# EasyEDA Pro project ProPrj_ODrive_2025-02-09.epro, board ODrive1
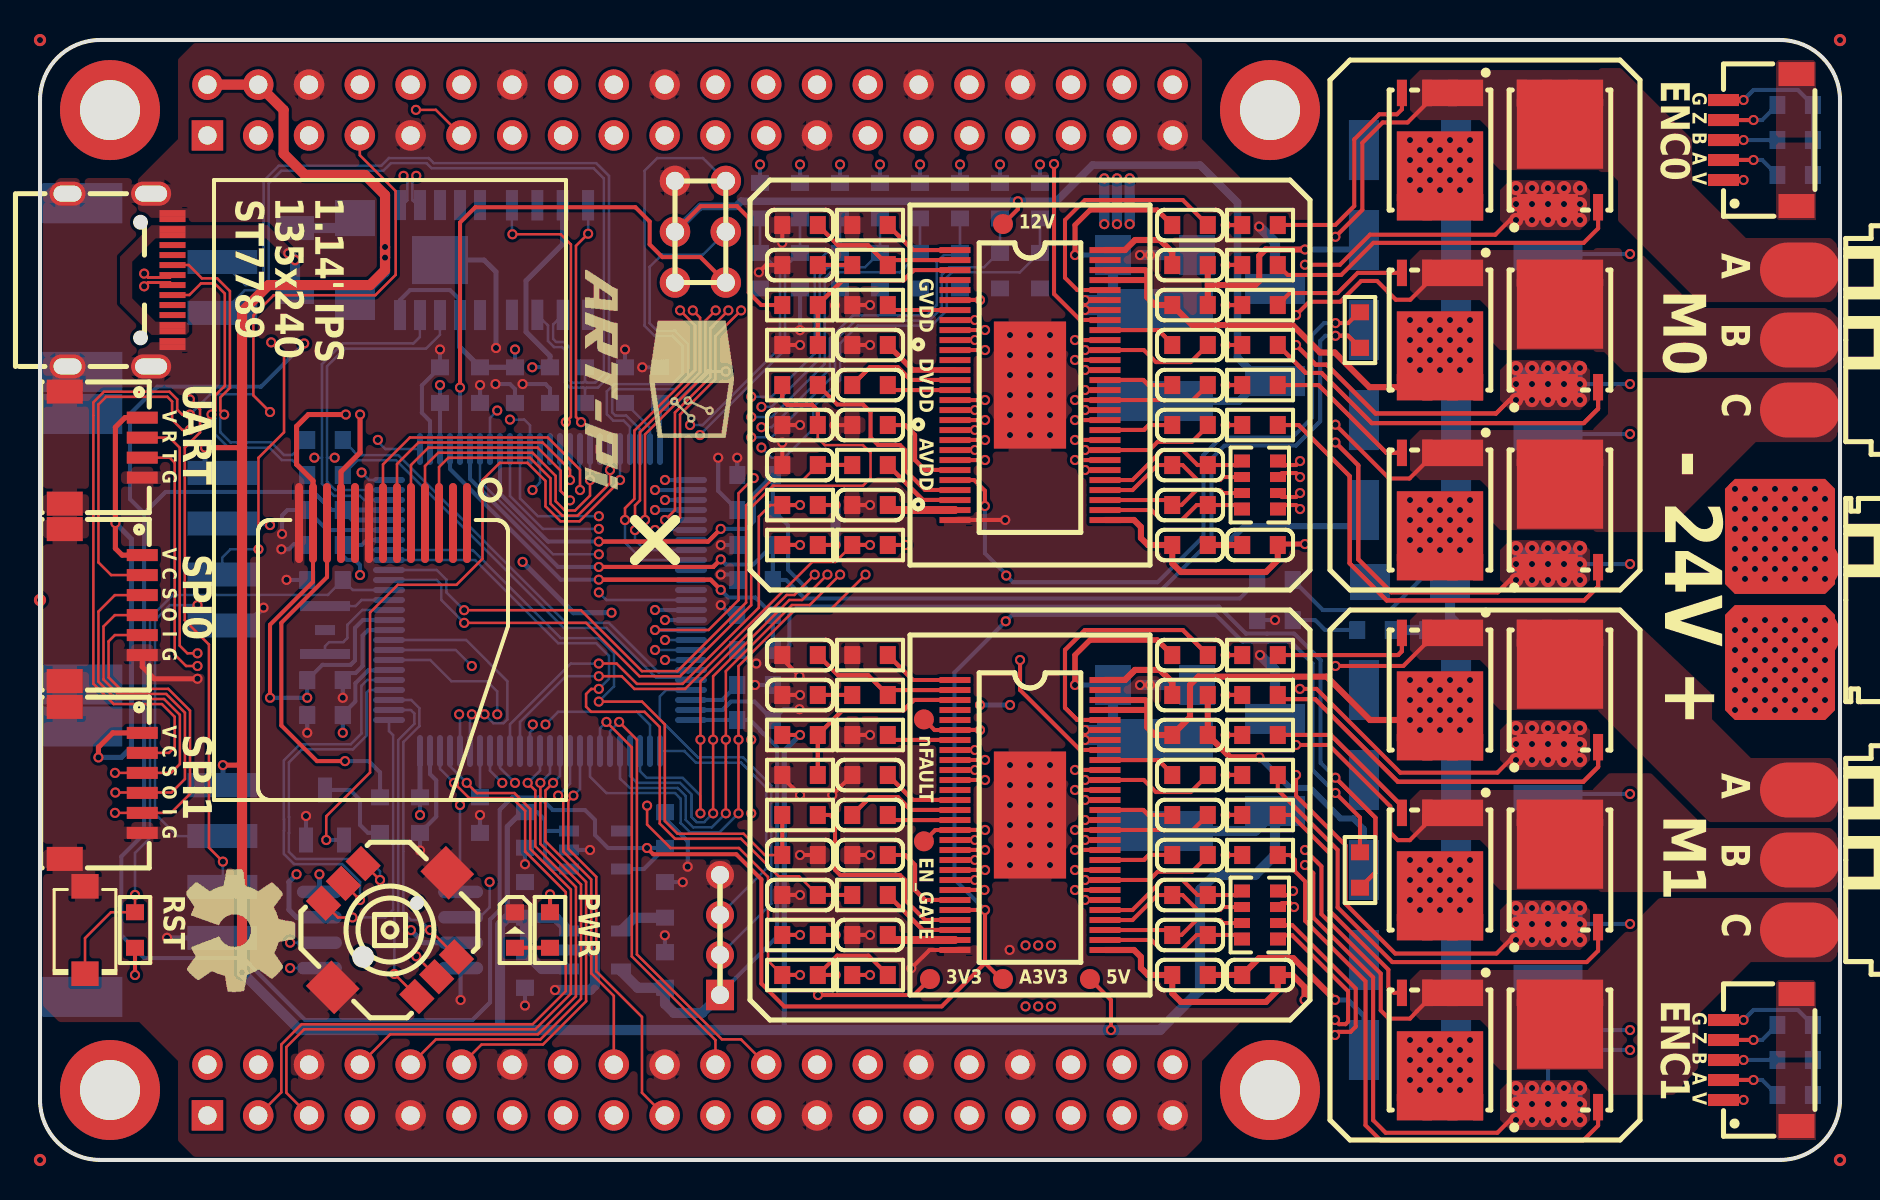
[diagram p9: board, top side]
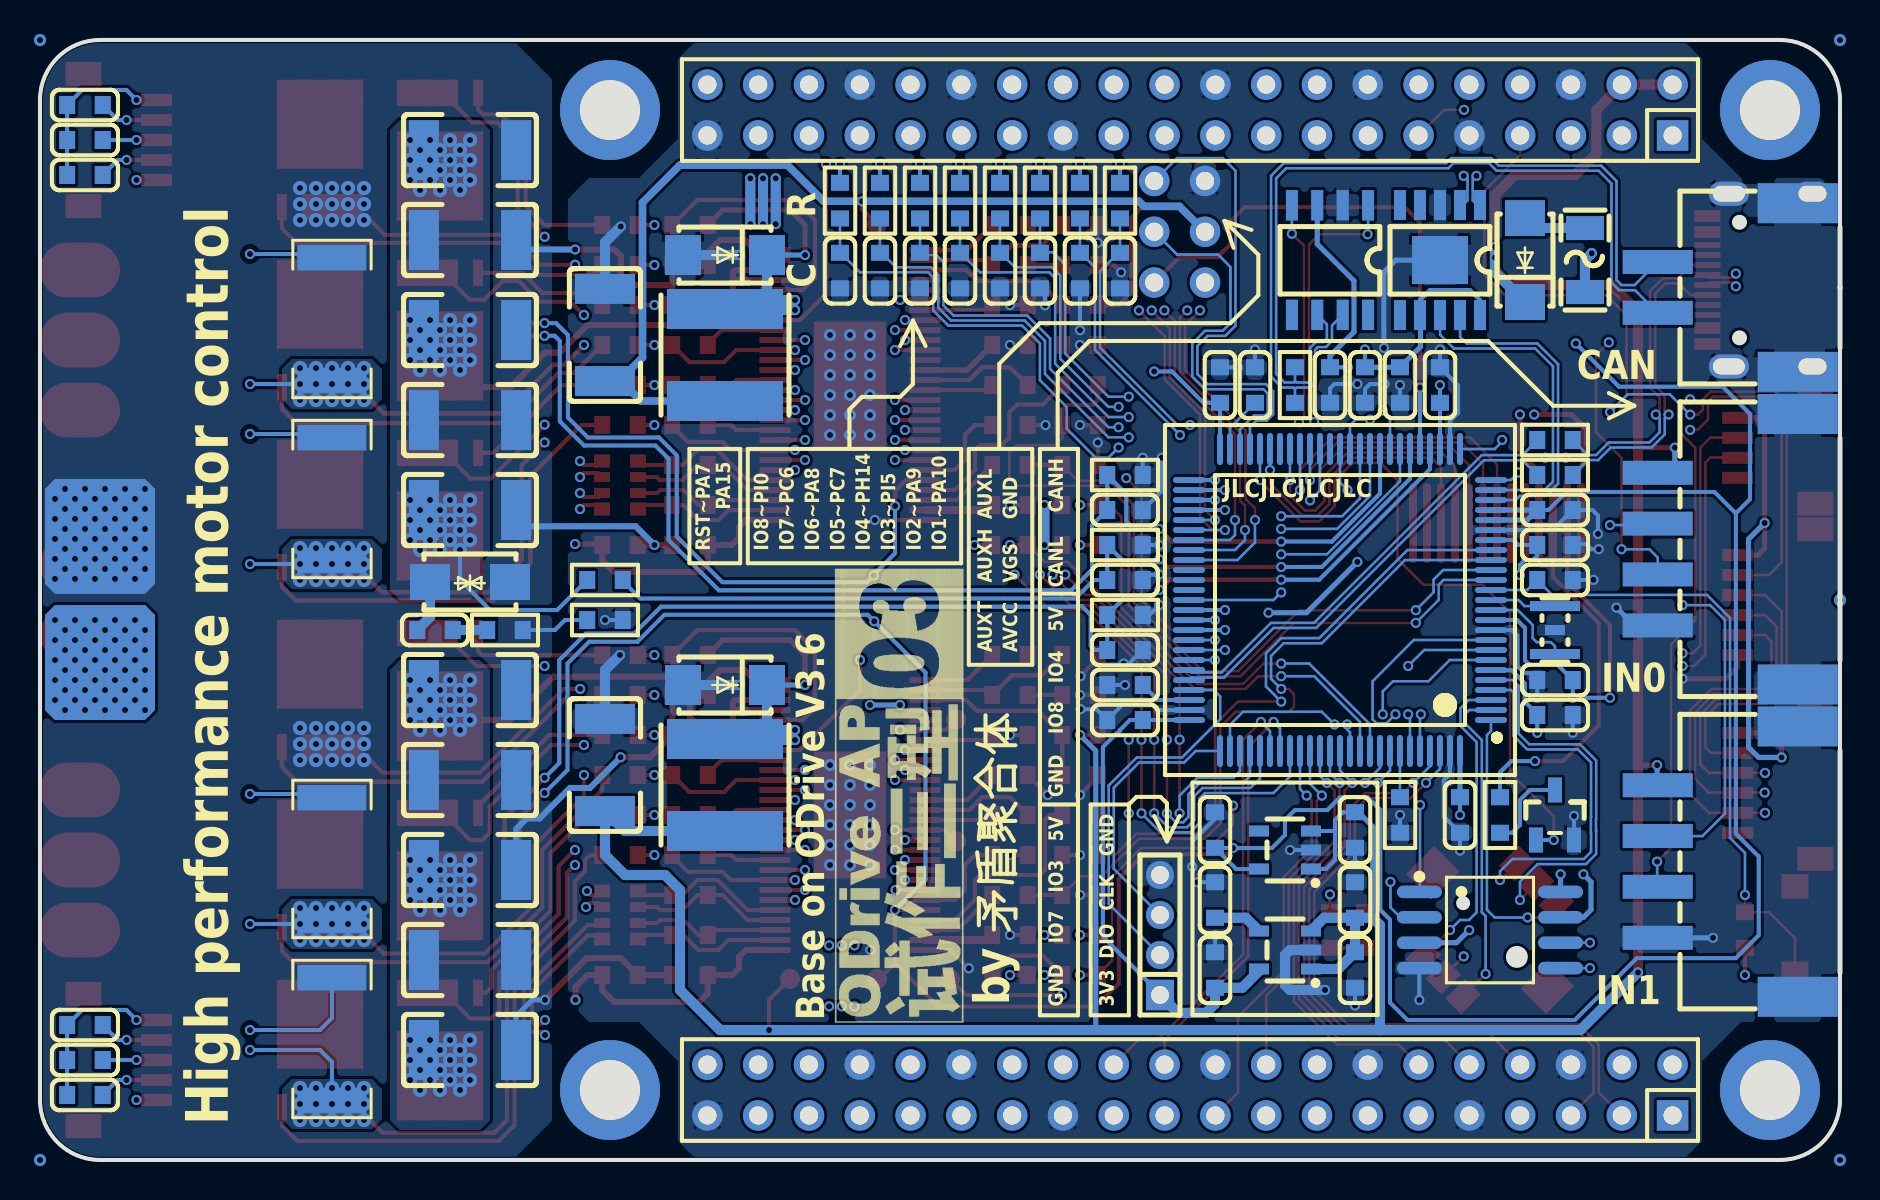
[diagram p10: board, bottom side, seen from below]

Outline 90 x 56 mm; copper layers: Top Layer, Inner1, Inner2, Bottom Layer. Coordinates in mm from the lower left corner of the outline.
Outline path: 0,53 arc(0.88,55.12) 3,56 87,56 arc(89.12,55.12) 90,53 90,3 arc(89.12,0.88) 87,0 3,0 arc(0.88,0.88) 0,3 0,53
Stack: Top Layer 0.035mm / Dielectric1 0.48mm PP er 4.5 / Inner1 0.035mm / Dielectric2 0.48mm FR4 er 4.5 / Inner2 0.035mm / Dielectric3 0.48mm PP er 4.5 / Bottom Layer 0.035mm

## Design rules (mm)
spacing Default (default): track to track 0.102, other pairs 0 to 0.102
track width Default (default): min 0.102, default 0.102, max 25.4
differential pair differentialPair (default): width min 0.127, default 0.254, max 2.54; gap min 0.152, default 0.152
via Default (default): diameter min 0.508, default 0.508, max 100.025; hole min 0.305, default 0.305, max 59.995
pour e1 uses gge36994
pour e3 uses gge16096
pour e7 uses gge36994(1)
pour e13 uses gge16096(1)
pour e2511 uses gge36994(2)
pour e2521 uses gge117911
pour e2523 uses gge117915
pour e2525 uses gge117920
pour e2527 uses gge118000
pour e2529 uses gge118003
pour e2531 uses gge118007
pour e3446 uses gge36994(3)
pour e3476 uses gge36994(4)
pour e3506 uses gge16096(2)

## Placement (name value [footprint] x y rotation side)
C1  82p/50V  [C0603]  48 44.47 270 bottom
C2  2.2u/50V  [C0603]  35.75 29 0 bottom
C3  82p/50V  [C0603]  50 44.47 270 bottom
C4  1u/16V  [C0603]  23.75 38.75 90 bottom
C5  100n/50V  [C0603]  22 38.75 90 bottom
C6  82p/50V  [C0603]  46 44.47 270 bottom
C7  100n/50V  [C0603]  25.5 38.75 90 bottom
C8  82p/50V  [C0603]  44 44.47 270 bottom
C9  82p/50V  [C0603]  42 44.47 270 bottom
C10  2.2u/50V  [C0603]  35.75 23.75 180 bottom
C11  2.2u/50V  [C0603]  29.25 38.75 270 bottom
C12  82p/50V  [C0603]  40 44.47 270 bottom
C13  100n/50V  [C0603]  14.25 30.75 0 bottom
C14  100n/50V  [C0603]  35.75 22 180 bottom
C15  100n/50V  [C0603]  20 38.75 270 bottom
C16  100n/50V  [C0603]  31 38.75 270 bottom
C17  100n/50V  [C0603]  19 17.25 90 bottom
C18  100n/50V  [C0603]  14.25 22.25 0 bottom
C19  100n/50V  [C0603]  14.25 24 180 bottom
C20  100n/50V  [C0603]  14.25 32.5 0 bottom
C21  82p/50V  [C0603]  38 44.47 270 bottom
C22  82p/50V  [C0603]  36 44.47 270 bottom
C23  100n/50V  [C0603]  14.25 29 0 bottom
C24  47uF/50V  [C1812]  68.5 10 180 bottom
C25  47uF/50V  [C1812]  68.5 23.5 180 bottom
C26  47uF/50V  [C1812]  68.5 19 180 bottom
C27  47uF/50V  [C1812]  68.5 50.5 180 bottom
C28  47uF/50V  [C1812]  68.5 41.5 180 bottom
C29  47uF/50V  [C1812]  68.5 14.5 180 bottom
C30  47uF/50V  [C1812]  68.5 46 180 bottom
C31  47uF/50V  [C1812]  68.5 32.5 180 bottom
C32  47uF/50V  [C1812]  68.5 37 180 bottom
C33  47uF/50V  [C1812]  68.5 5.5 180 bottom
C34  1u/16V  [C0603]  24.25 16.5 90 bottom
C35  1u/16V  [C0603]  31.25 16.5 270 bottom
C36  10uF/10V  [C0603]  24.25 13 270 bottom
C37  100n/50V  [C0603]  24.25 9.5 90 bottom
C38  10uF/10V  [C0603]  31.25 9.5 270 bottom
C39  22n/50V  [C0603]  31.25 13 270 bottom
C40  100n/50V  [C0603]  70.25 26.5 0 bottom
C41  3.3n/50V  [C0603]  57.5 44.75 180 top
C42  6.8p/50V  [C0603]  38 46.75 0 top
C43  5.1n/50V  [C0603]  38 44.75 0 top
C44  2.2u/50V  [C0603]  57.5 42.75 180 top
C45  100n/50V  [C0603]  57.5 46.75 180 top
C46  47u/35V  [C1812]  61.75 41.25 270 bottom
C47  2.2u/50V  [C0603]  35.75 32.5 0 bottom
C48  100n/50V  [C0603]  57.5 40.75 180 top
C49  2.2u/50V  [C0603]  41.5 40.75 0 top
C50  22n/50V  [C0603]  41.5 38.75 180 top
C51  100n/50V  [C0603]  57.5 38.75 180 top
C52  2.2u/50V  [C0603]  41.5 36.75 180 top
C53  100n/50V  [C0603]  57.5 36.75 180 top
C54  2.2n/50V  [C0603]  57.5 34.75 0 top
C55  2.2n/50V  [C0603]  38 36.75 0 top
C56  2.2n/50V  [C0603]  38 34.75 0 top
C57  2.2n/50V  [C0603]  57.5 32.75 180 top
C58  2.2u/50V  [C0603]  41.5 32.75 0 top
C59  100n/50V  [C0603]  57.5 30.75 180 top
C60  4.7u/35V  [C0603]  61 30.75 0 top
C61  6.8n/100V  [C0603]  57.5 23.25 180 top
C62  6.8p/50V  [C0603]  38 25.25 0 top
C63  4.3n/50V  [C0603]  38 23.25 0 top
C64  2.2u/50V  [C0603]  57.5 21.25 180 top
C65  100n/50V  [C0603]  57.5 25.25 180 top
C66  47u/35V  [C1812]  61.75 19.75 270 bottom
C67  2.2u/50V  [C0603]  35.75 25.5 0 bottom
C68  100n/50V  [C0603]  57.5 19.25 180 top
C69  2.2u/50V  [C0603]  41.5 19.25 0 top
C70  22n/50V  [C0603]  41.5 17.25 180 top
C71  100n/50V  [C0603]  57.5 17.25 180 top
C72  2.2u/50V  [C0603]  41.5 15.25 180 top
C73  100n/50V  [C0603]  57.5 15.25 180 top
C74  2.2n/50V  [C0603]  57.5 13.25 0 top
C75  2.2n/50V  [C0603]  38 15.25 180 top
C76  2.2n/50V  [C0603]  38 13.25 0 top
C77  2.2n/50V  [C0603]  57.5 11.25 180 top
C78  2.2u/50V  [C0603]  41.5 11.25 0 top
C79  100n/50V  [C0603]  57.5 9.25 180 top
C80  4.7u/35V  [C0603]  61 9.25 0 top
C81  40n/50V  [C0603]  87.75 51 180 bottom
C82  40n/50V  [C0603]  87.75 52.75 180 bottom
C83  40n/50V  [C0603]  87.75 49.25 180 bottom
C84  40n/50V  [C0603]  87.75 6.75 180 bottom
C85  40n/50V  [C0603]  87.75 5 180 bottom
C86  40n/50V  [C0603]  87.75 3.25 180 bottom
CN1  M1010RS-04P  [CONN-SMD_M1010RS-04P]  3.18 35.62 270 top
CN2  XH2.54-2P  [CONN-SMD_2.54-2P-WT]  5.71 43.62 90 bottom
CN3  XH2.54-4P  [CONN-SMD_2.54-4P-WT]  5.71 14.92 90 bottom
CN4  M1010RS-06P  [CONN-SMD_M1010RS-06P]  3.17 27.74 270 top
CN5  XH2.54-4P  [CONN-SMD_2.54-4P-WT]  5.71 30.54 90 bottom
CN6  M1010RS-06P  [CONN-SMD_M1010RS-06P]  3.17 18.85 270 top
CN7  M1010RS-05P  [CONN-SMD_M1010RS-05P]  86 51 270 top
CN8  M1010RS-05P  [CONN-SMD_M1010RS-05P]  86 5 270 top
D1  SS34  [SMA_L4.4-W2.8-LS5.4-RD]  15.75 45 90 bottom
D2  SMAJ30CA_C266339  [SMA_L4.4-W2.6-LS5.0-BI]  68.5 28.9 180 bottom
D3  SS34  [SMA_L4.4-W2.8-LS5.4-RD]  55.75 45.25 0 bottom
D4  SS34  [SMA_L4.4-W2.8-LS5.4-RD]  55.75 23.75 0 bottom
F1  FSMD012-1206-R  [F1206]  12.75 45 270 bottom
H1  PZ200V-11-04P  [HDR-TH_4P-P2.00-V-M]  34 11.25 90 bottom
H2  -  [XT30U-M]  88 28 270 top
H3  ODRIVE  [ODRIVE_LOGO_H3.5]  30.75 17.75 270 top
H4  OSHW  [OSHW_LOGO_H10——NOTEXT]  9 11.5 270 top
H5  ART Pi  [MoonGrt]  31 39 270 top
H6  试作二型  [试作三型_LOGO]  47.06 18.2 90 bottom
H7  -  [MR30-M]  88 41 270 top
H8  -  [MR30-M]  88 15 270 top
KEY  TM-4175-B-B  [SW-SMD_TM-4175-B-B]  17.5 11.5 315 top
L1  120uH  [IND-SMD_L6.0-W6.0]  55.75 40.25 270 bottom
L2  22uH  [IND-SMD_L6.0-W6.0]  55.75 18.75 270 bottom
LED1  LED-0603_B  [LED0603_BLUE]  23.75 11.5 90 top
NOREF  -  [Pad_e3508]  87 31.18 0 top
NOREF#2  -  [Pad_e6219]  3.5 52.5 270 top
NOREF#3  -  [Pad_e2534]  87 24.87 0 top
NOREF#4  -  [Pad_e2533]  87 31.18 0 top
NOREF#5  -  [Pad_e3509]  87 24.87 0 top
NOREF#6  -  [Pad_e6221]  3.5 3.5 270 top
NOREF#7  -  [Pad_e6222]  61.5 3.5 270 top
NOREF#8  -  [Pad_e6220]  61.5 52.5 270 top
P1  ART-Pi -P1扩展引脚  [MY_HDR-TH_40P-P2.54-V-M-R2-C20-S2.54]  32.5 52.5 0 top
P2  ART-Pi -P2扩展引脚  [MY_HDR-TH_40P-P2.54-V-M-R2-C20-S2.54]  32.5 3.5 0 top
PIN1  -  [1PIN]  31.75 46.41 0 top
PIN2  -  [1PIN]  34.29 43.87 0 top
PIN3  -  [1PIN]  34.29 48.95 0 top
PIN4  -  [1PIN]  34.29 46.41 0 top
PIN5  -  [1PIN]  31.75 48.95 0 top
PIN6  -  [1PIN]  31.75 43.87 0 top
Q1  KRC116S-RTK/P  [SOT-23-3_L2.9-W1.6-P1.90-LS2.8-BR]  14.25 17.25 270 bottom
Q2  KNY3406C  [PDFNWB-8L_L6.0-W5.0-P1.27-BL-EP_CON]  70 50.5 180 top
Q3  KNY3406C  [PDFNWB-8L_L6.0-W5.0-P1.27-BL-EP_CON]  70 41.5 180 top
Q4  KNY3406C  [PDFNWB-8L_L6.0-W5.0-P1.27-BL-EP_CON]  70 32.5 180 top
Q5  KNY3406C  [PDFNWB-8L_L6.0-W5.0-P1.27-BL-EP_CON]  76 50.5 0 top
Q6  KNY3406C  [PDFNWB-8L_L6.0-W5.0-P1.27-BL-EP_CON]  76 41.5 0 top
Q7  KNY3406C  [PDFNWB-8L_L6.0-W5.0-P1.27-BL-EP_CON]  76 32.5 0 top
Q8  KNY3406C  [PDFNWB-8L_L6.0-W5.0-P1.27-BL-EP_CON]  70 23.5 180 top
Q9  KNY3406C  [PDFNWB-8L_L6.0-W5.0-P1.27-BL-EP_CON]  70 14.5 180 top
Q10  KNY3406C  [PDFNWB-8L_L6.0-W5.0-P1.27-BL-EP_CON]  70 5.5 180 top
Q11  KNY3406C  [PDFNWB-8L_L6.0-W5.0-P1.27-BL-EP_CON]  76 23.5 0 top
Q12  KNY3406C  [PDFNWB-8L_L6.0-W5.0-P1.27-BL-EP_CON]  76 14.5 0 top
Q13  KNY3406C  [PDFNWB-8L_L6.0-W5.0-P1.27-BL-EP_CON]  76 5.5 0 top
R1  3.3k  [R0603]  48 47.97 270 bottom
R2  10k  [R0603]  61.75 29 180 bottom
R3  22R  [R0603]  14.25 34.25 180 bottom
R4  1k  [R0603]  35.75 30.75 180 bottom
R5  3.3k  [R0603]  50 47.97 270 bottom
R6  22R  [R0603]  14.25 36 180 bottom
R7  3.3k  [R0603]  46 47.97 270 bottom
R8  120R  [R0603]  27.25 38.75 90 bottom
R9  3.3k  [R0603]  44 47.97 270 bottom
R10  1k  [R0603]  25.5 11.5 270 top
R11  3.3k  [R0603]  42 47.97 270 bottom
R12  10k  [R0603]  22 17.25 270 bottom
R13  3.3k  [R0603]  40 47.97 270 bottom
R14  3.3k  [R0603]  38 47.97 270 bottom
R15  10R  [R0603]  17 17.25 90 bottom
R16  3.3k  [R0603]  36 47.97 270 bottom
R17  10k  [R0603]  4.75 11.5 90 top
R18  3.3R  [R0603]  66.75 26.5 0 bottom
R19  0R  [R0603]  61.75 27 180 bottom
R20  133k  [R0603]  41.5 44.75 180 top
R21  562k  [R0603]  41.5 46.75 180 top
R22  140k  [R0603]  38 42.75 0 top
R23  3.3k  [R0603]  41.5 30.75 180 top
R24  3.3k  [R0603]  38 32.75 180 top
R25  3.3k  [R0603]  38 30.75 180 top
R26  10k  [R0603]  38 40.75 180 top
R27  18k  [R0603]  41.5 42.75 180 top
R28  3.3k  [R0603]  35.75 34.25 180 bottom
R29  22R  [R0603]  38 38.75 180 top
R30  22R  [R0603]  41.5 34.75 180 top
R31  2.2R  [R0603]  61 46.75 180 top
R32  2.2R  [R0603]  61 42.75 180 top
R33  2.2R  [R0603]  61 38.75 180 top
R34  2.2R  [R0603]  61 44.75 180 top
R35  2.2R  [R0603]  61 40.75 180 top
R36  2.2R  [R0603]  61 36.75 180 top
R37  0.0005  [R2512]  75.4 42.05 270 bottom
R38  0.0005  [R2512]  75.4 33.05 270 bottom
R39  86.6k  [R0603]  41.5 23.25 180 top
R40  365k  [R0603]  41.5 25.25 180 top
R41  52.3k  [R0603]  38 21.25 0 top
R42  3.3k  [R0603]  41.5 9.25 180 top
R43  3.3k  [R0603]  38 11.25 180 top
R44  3.3k  [R0603]  38 9.25 180 top
R45  10k  [R0603]  38 19.25 180 top
R46  18k  [R0603]  41.5 21.25 180 top
R47  3.3k  [R0603]  35.75 27.25 180 bottom
R48  22R  [R0603]  38 17.25 180 top
R49  22R  [R0603]  41.5 13.25 180 top
R50  2.2R  [R0603]  61 25.25 180 top
R51  2.2R  [R0603]  61 21.25 180 top
R52  2.2R  [R0603]  61 17.25 180 top
R53  2.2R  [R0603]  61 23.25 180 top
R54  2.2R  [R0603]  61 19.25 180 top
R55  2.2R  [R0603]  61 15.25 180 top
R56  0.0005  [R2512]  75.4 15.05 270 bottom
R57  0.0005  [R2512]  75.4 6.05 270 bottom
RN1  100R  [RES-ARRAY-SMD_0603-8P-L3.2-W1.6-BL]  61 33.75 90 top
RN2  100R  [RES-ARRAY-SMD_0603-8P-L3.2-W1.6-BL]  61 12.25 90 top
RT1  10k  [R0603]  66 41.5 90 top
RT2  10k  [R0603]  66 14.5 90 top
SW1  TS-1088R-02026  [SW-SMD_L3.9-W3.0-P4.45]  2.25 11.5 270 top
TFT1  焊接式_TFT_1.14_135x240_13pin  [焊接式_TFT_1.14_135X240_13PIN]  17.5 18 270 top
TP1  Testpoint 1.6mm  [TESTPOINT 1.6MM#2]  44.19 15.93 0 top
TP2  Testpoint 1.6mm  [TESTPOINT 1.6MM#2]  44.19 22.03 0 top
TP3  Testpoint 1.6mm  [TESTPOINT 1.6MM#2]  44.5 9.05 0 top
TP4  Testpoint 1.6mm  [TESTPOINT 1.6MM#2]  48.15 9.05 0 top
TP5  Testpoint 1.6mm  [TESTPOINT 1.6MM#2]  52.5 9.05 0 top
TP6  Testpoint 1.6mm  [TESTPOINT 1.6MM]  49.05 46.8 0 top
U1  W25Q32FVSSIGTR  [SOIC-8_L5.3-W5.3-P1.27-LS8.0-BL]  17.5 11.5 270 bottom
U2  CH340K  [ESOP-10_L4.9-W3.9-P1.00-LS6.2-BL-EP]  20 45 0 bottom
U3  STM32F405VGT6  [LQFP-100_L14.0-W14.0-P0.50-LS16.0-BL]  25 28 90 bottom
U4  SN65HVD232DR  [SOIC-8_L5.0-W4.0-P1.27-LS6.0-BL]  25.5 45 0 bottom
U6  LP5907MFX-3.3/NOPB  [SOT-23-5_L3.0-W1.7-P0.95-LS2.8-BR]  27.75 15.5 180 bottom
U7  DRV8301DCAR  [HTSSOP-56_L14.0-W6.0-P0.50-LS8.0-BL]  49.5 38.75 270 top
U8  DRV8301DCAR  [HTSSOP-56_L14.0-W6.0-P0.50-LS8.0-BL]  49.5 17.25 270 top
U9  RT9193-33GB  [SOT-23-5_L3.0-W1.7-P0.95-LS2.8-BR]  27.75 10.5 180 bottom
USBC1  TYPE-C-31-M-12  [USB-C_SMD-TYPE-C-31-M-12]  4 44 270 top
X1  8MHz  [OSC-SMD_3P-L3.2-W1.3-P1.2-L]  14.25 26.5 90 bottom

## Footprints (pads in the part's own frame, mm; a bottom-side part is the same pattern mirrored in y, then rotated)
1PIN
  round 1.524 hole 0.914: 1(0,0)
C0603
  rect 0.8x0.9 smd: 1(-0.889,0) 2(0.889,0)
C1812
  rect 1.5x3 smd: 1(-2.305,0) 2(2.305,0)
CONN-SMD_2.54-2P-WT
  rect 2x4 smd: 0(-4.21,-3.6) 0(4.22,-3.6)
  rect 1.2x3.5 smd: 1(1.28,3.4) 2(-1.26,3.4)
CONN-SMD_2.54-4P-WT
  rect 2x4 smd: 0(-6.76,-3.6) 0(6.76,-3.6)
  rect 1.2x3.5 smd: 1(3.82,3.4) 2(1.28,3.4) 3(-1.26,3.4) 4(-3.81,3.4)
CONN-SMD_M1010RS-04P
  rect 0.6x1.55 smd: 1(-1.5,1.938) 2(-0.5,1.938) 3(0.5,1.938) 4(1.5,1.938)
  rect 1.2x1.8 smd: 5(2.8,-1.938) 6(-2.8,-1.938)
CONN-SMD_M1010RS-05P
  rect 0.6x1.55 smd: 1(2,-1.825) 2(1,-1.825) 3(0,-1.825) 4(-1,-1.825) 5(-2,-1.825)
  rect 1.2x1.8 smd: 6(-3.3,1.825) 7(3.3,1.825)
CONN-SMD_M1010RS-06P
  rect 0.6x1.55 smd: 1(-2.5,1.938) 2(-1.5,1.938) 3(-0.5,1.938) 4(0.5,1.938) 5(1.5,1.938) 6(2.5,1.938)
  rect 1.2x1.8 smd: 7(3.8,-1.938) 8(-3.8,-1.938)
ESOP-10_L4.9-W3.9-P1.00-LS6.2-BL-EP
  rect 2.8x2.4 smd: 0(0,0)
  rect 0.6x1.5 smd: 1(-2,-2.75) 2(-1,-2.75) 3(0,-2.75) 4(1,-2.75) 5(2,-2.75) 6(2,2.75) 7(1,2.75) 8(0,2.75) 9(-1,2.75) 10(-2,2.75)
F1206
  rect 1.2x1.9 smd: 1(-1.6,0) 2(1.6,0)
HDR-TH_4P-P2.00-V-M
  rect 1.524x1.4 hole 0.9: 1(-3,0)
  round 1.4 hole 0.9: 2(-1,0) 3(1,0) 4(3,0)
HTSSOP-56_L14.0-W6.0-P0.50-LS8.0-BL
  rect 0.3x1.55 smd: 1(-6.75,-3.75) 2(-6.25,-3.75) 3(-5.75,-3.75) 4(-5.25,-3.75) 5(-4.75,-3.75) 6(-4.25,-3.75) 7(-3.75,-3.75) 8(-3.25,-3.75) 9(-2.75,-3.75) 10(-2.25,-3.75) 11(-1.75,-3.75) 12(-1.25,-3.75) 13(-0.75,-3.75) 14(-0.25,-3.75) 15(0.25,-3.75) 16(0.75,-3.75) 17(1.25,-3.75) 18(1.75,-3.75) 19(2.25,-3.75) 20(2.75,-3.75) 21(3.25,-3.75) 22(3.75,-3.75) 23(4.25,-3.75) 24(4.75,-3.75) 25(5.25,-3.75) 26(5.75,-3.75) 27(6.25,-3.75) 28(6.75,-3.75) 29(6.75,3.75) 30(6.25,3.75) 31(5.75,3.75) 32(5.25,3.75) 33(4.75,3.75) 34(4.25,3.75) 35(3.75,3.75) 36(3.25,3.75) 37(2.75,3.75) 38(2.25,3.75) 39(1.75,3.75) 40(1.25,3.75) 41(0.75,3.75) 42(0.25,3.75) 43(-0.25,3.75) 44(-0.75,3.75) 45(-1.25,3.75) 46(-1.75,3.75) 47(-2.25,3.75) 48(-2.75,3.75) 49(-3.25,3.75) 50(-3.75,3.75) 51(-4.25,3.75) 52(-4.75,3.75) 53(-5.25,3.75) 54(-5.75,3.75) 55(-6.25,3.75) 56(-6.75,3.75)
  rect 6.35x3.61 smd: 57(0,0)
IND-SMD_L6.0-W6.0
  rect 2x5.8 smd: 1(-2.3,0) 2(2.3,0)
LED0603_BLUE
  rect 0.8x0.9 smd: 1(-0.889,0) 2(0.888,0)
LQFP-100_L14.0-W14.0-P0.50-LS16.0-BL
  oval 0.3x1.6 smd: 1(-6,-7.55) 2(-5.5,-7.55) 3(-5,-7.55) 4(-4.5,-7.55) 5(-4,-7.55) 6(-3.5,-7.55) 7(-3,-7.55) 8(-2.5,-7.55) 9(-2,-7.55) 10(-1.5,-7.55) 11(-1,-7.55) 12(-0.5,-7.55) 13(0,-7.55) 14(0.5,-7.55) 15(1,-7.55) 16(1.5,-7.55) 17(2,-7.55) 18(2.5,-7.55) 19(3,-7.55) 20(3.5,-7.55) 21(4,-7.55) 22(4.5,-7.55) 23(5,-7.55) 24(5.5,-7.55) 25(6,-7.55) 51(6,7.55) 52(5.5,7.55) 53(5,7.55) 54(4.5,7.55) 55(4,7.55) 56(3.5,7.55) 57(3,7.55) 58(2.5,7.55) 59(2,7.55) 60(1.5,7.55) 61(1,7.55) 62(0.5,7.55) 63(0,7.55) 64(-0.5,7.55) 65(-1,7.55) 66(-1.5,7.55) 67(-2,7.55) 68(-2.5,7.55) 69(-3,7.55) 70(-3.5,7.55) 71(-4,7.55) 72(-4.5,7.55) 73(-5,7.55) 74(-5.5,7.55) 75(-6,7.55)
  oval 1.6x0.3 smd: 26(7.55,-6) 27(7.55,-5.5) 28(7.55,-5) 29(7.55,-4.5) 30(7.55,-4) 31(7.55,-3.5) 32(7.55,-3) 33(7.55,-2.5) 34(7.55,-2) 35(7.55,-1.5) 36(7.55,-1) 37(7.55,-0.5) 38(7.55,0) 39(7.55,0.5) 40(7.55,1) 41(7.55,1.5) 42(7.55,2) 43(7.55,2.5) 44(7.55,3) 45(7.55,3.5) 46(7.55,4) 47(7.55,4.5) 48(7.55,5) 49(7.55,5.5) 50(7.55,6) 76(-7.55,6) 77(-7.55,5.5) 78(-7.55,5) 79(-7.55,4.5) 80(-7.55,4) 81(-7.55,3.5) 82(-7.55,3) 83(-7.55,2.5) 84(-7.55,2) 85(-7.55,1.5) 86(-7.55,1) 87(-7.55,0.5) 88(-7.55,0) 89(-7.55,-0.5) 90(-7.55,-1) 91(-7.55,-1.5) 92(-7.55,-2) 93(-7.55,-2.5) 94(-7.55,-3) 95(-7.55,-3.5) 96(-7.55,-4) 97(-7.55,-4.5) 98(-7.55,-5) 99(-7.55,-5.5) 100(-7.55,-6)
MR30-M
  oval 2.75x4 smd: 1(-3.5,0) 2(0,0) 3(3.5,0)
MY_HDR-TH_40P-P2.54-V-M-R2-C20-S2.54
  rect 1.575x1.524 hole 0.914: 1(-24.13,-1.27)
  round 1.524 hole 0.914: 2(-24.13,1.27) 3(-21.59,-1.27) 4(-21.59,1.27) 5(-19.05,-1.27) 6(-19.05,1.27) 7(-16.51,-1.27) 8(-16.51,1.27) 9(-13.97,-1.27) 10(-13.97,1.27) 11(-11.43,-1.27) 12(-11.43,1.27) 13(-8.89,-1.27) 14(-8.89,1.27) 15(-6.35,-1.27) 16(-6.35,1.27) 17(-3.81,-1.27) 18(-3.81,1.27) 19(-1.27,-1.27) 20(-1.27,1.27) 21(1.27,-1.27) 22(1.27,1.27) 23(3.81,-1.27) 24(3.81,1.27) 25(6.35,-1.27) 26(6.35,1.27) 27(8.89,-1.27) 28(8.89,1.27) 29(11.43,-1.27) 30(11.43,1.27) 31(13.97,-1.27) 32(13.97,1.27) 33(16.51,-1.27) 34(16.51,1.27) 35(19.05,-1.27) 36(19.05,1.27) 37(21.59,-1.27) 38(21.59,1.27) 39(24.13,-1.27) 40(24.13,1.27)
OSC-SMD_3P-L3.2-W1.3-P1.2-L
  rect 0.5x2.5 smd: 1(-1.199,0) 3(1.199,0)
  rect 0.5x1 smd: 2(0,0)
Pad_e2533
  custom 0x0 smd: 1(0,0)
Pad_e2534
  custom 0x0 smd: 4(0,0)
Pad_e3508
  custom 0x0 smd far side: 3(0,0)
Pad_e3509
  custom 0x0 smd far side: 2(0,0)
Pad_e6219
  round 5 hole 3: N(0,0)
Pad_e6220
  round 5 hole 3: N(0,0)
Pad_e6221
  round 5 hole 3: N(0,0)
Pad_e6222
  round 5 hole 3: N(0,0)
PDFNWB-8L_L6.0-W5.0-P1.27-BL-EP_CON
  rect 3.048x1.321 smd: 1(-0.635,-2.857)
  rect 0.5x1.321 smd: 2(-0.635,-2.857) 3(0.635,-2.857) 4(1.905,-2.857) 6(0.635,2.857) 7(-0.635,2.857) 8(-1.905,2.857)
  rect 4.318x1.321 smd: 5(0,2.857)
  rect 4.318x3.5 smd: 8(0,0.812)
R0603
  rect 0.8x0.9 smd: 1(-0.889,0) 2(0.889,0)
R2512
  rect 1.282x3.456 smd: 1(-3.067,0) 2(3.067,0)
RES-ARRAY-SMD_0603-8P-L3.2-W1.6-BL
  rect 0.65x0.8 smd: 1(-1.2,-0.9) 4(1.2,-0.9) 5(1.2,0.9) 8(-1.2,0.9)
  rect 0.5x0.8 smd: 2(-0.4,-0.9) 3(0.4,-0.9) 6(0.4,0.9) 7(-0.4,0.9)
SMA_L4.4-W2.6-LS5.0-BI
  rect 2x1.8 smd: 1(-2,0) 2(2,0)
SMA_L4.4-W2.8-LS5.4-RD
  rect 1.8x2 smd: 1(-2.1,0) 2(2.1,0)
SOIC-8_L5.0-W4.0-P1.27-LS6.0-BL
  rect 0.6x1.52 smd: 1(-1.905,-2.74) 2(-0.635,-2.74) 3(0.635,-2.74) 4(1.905,-2.74) 5(1.905,2.74) 6(0.635,2.74) 7(-0.635,2.74) 8(-1.905,2.74)
SOIC-8_L5.3-W5.3-P1.27-LS8.0-BL
  oval 0.63x2.25 smd: 1(-1.905,-3.53) 2(-0.635,-3.53) 3(0.635,-3.53) 4(1.905,-3.53) 5(1.905,3.53) 6(0.635,3.53) 7(-0.635,3.53) 8(-1.905,3.53)
SOT-23-3_L2.9-W1.6-P1.90-LS2.8-BR
  rect 1.25x0.7 smd: 1(1.25,-0.95) 2(1.25,0.95) 3(-1.25,0)
SOT-23-5_L3.0-W1.7-P0.95-LS2.8-BR
  rect 1x0.55 smd: 1(1.3,-0.95) 2(1.3,0) 3(1.3,0.95) 4(-1.3,0.95) 5(-1.3,-0.95)
SW-SMD_L3.9-W3.0-P4.45
  rect 1.23x1.36 smd: 1(-2.185,0) 2(2.185,0)
SW-SMD_TM-4175-B-B
  rect 1.4x1.1 smd: 1(-3.3,1.4) 2(-3.3,0) 3(-3.3,-1.4) 4(3.3,1.4) 5(3.3,0) 6(3.3,-1.4)
  rect 2x1.8 smd: 7(0,-4.05) 8(0,4.05)
TESTPOINT 1.6MM
  round 1 smd: 1(-0.9,0)
TESTPOINT 1.6MM#2
  round 1 smd: 1(0,0)
USB-C_SMD-TYPE-C-31-M-12
  oval 1.2x2 hole 0.8x1.6: 0(-4.32,1.556) 0(4.32,1.556)
  oval 1.2x1.8 hole 0.8x1.4: 0(-4.32,-2.624) 0(4.32,-2.624)
  rect 0.3x1.3 smd: A1(-3.35,2.623) A4(-2.55,2.623) A5(-1.25,2.623) A6(-0.25,2.623) A7(0.25,2.623) A8(1.25,2.624) A9(2.55,2.623) A12(3.35,2.623) B1(3.05,2.623) B4(2.25,2.623) B5(1.75,2.623) B6(0.75,2.623) B7(-0.75,2.623) B8(-1.75,2.624) B9(-2.25,2.623) B12(-3.05,2.623)
XT30U-M
  oval 2.75x4 smd: 1(-1.778,0) 2(1.722,0)
焊接式_TFT_1.14_135X240_13PIN
  oval 4x0.4 smd: 1(-13.85,3.85) 2(-13.85,3.15) 3(-13.85,2.45) 4(-13.85,1.75) 5(-13.85,1.05) 6(-13.85,0.35) 7(-13.85,-0.35) 8(-13.85,-1.05) 9(-13.85,-1.75) 10(-13.85,-2.45) 11(-13.85,-3.15) 12(-13.85,-3.85) 13(-13.85,-4.55)

## Nets
As in the schematic, except:
PGND: C24.2 C25.2 C26.2 C27.2 C28.2 C29.2 C30.2 C31.2 C32.2 C33.2 C41.1 C44.1 C59.1 C60.1 C61.1 C64.1 C79.1 C80.1 D2.2 H2.1 NOREF.3 NOREF#4.1 Q5.1 Q5.2 Q5.3 Q11.1 Q11.2 Q11.3 R18.1 R19.1 R37.1 R38.1 R56.1 R57.1 RN1.1 RN1.3 RN2.1 RN2.3 U7.44 U8.44
DCBUS: C24.1 C25.1 C26.1 C27.1 C28.1 C29.1 C30.1 C31.1 C32.1 C33.1 C40.2 C44.2 C59.2 C60.2 C64.2 C79.2 C80.2 D2.1 H2.2 NOREF#3.4 NOREF#5.2 Q2.5 Q2.6 Q2.7 Q2.8 Q3.5 Q3.6 Q3.7 Q3.8 Q4.5 Q4.6 Q4.7 Q4.8 Q8.5 Q8.6 Q8.7 Q8.8 Q9.5 Q9.6 Q9.7 Q9.8 Q10.5 Q10.6 Q10.7 Q10.8 R2.1 U7.29 U7.53 U7.54 U8.29 U8.53 U8.54
M0_SN1: Q6.1 Q6.2 Q6.3 R37.2 RN1.4 U7.39
M0_SN2: Q7.1 Q7.2 Q7.3 R38.2 RN1.2 U7.34
M1_SN1: Q12.1 Q12.2 Q12.3 R56.2 RN2.4 U8.39
M1_SN2: Q13.1 Q13.2 Q13.3 R57.2 RN2.2 U8.34

Pads without a net: CN7 6 7; CN8 6 7; NOREF#2 N; NOREF#7 N; NOREF#8 N; P1 1 3 5 13 15 17 27 29 31 32 33 35 36 37 38 40; P2 1 2 4 7 11 13 15 16 17 21 23 26 27 28 29 31 32 33 35 36 37 38 40; TFT1 1 2 9; U2 4 5 6; U3 39 44 60 61 62; U4 5 8; U6 4; U7 4 5 12 55; U8 4 5 12 55; USBC1 A5 A8 B5 B8

## Via types
v1: diameter 0.61, hole 0.305, Top Layer to Bottom Layer, 41 vias
v2: diameter 0.711, hole 0.305, Top Layer to Bottom Layer, 316 vias
v3: diameter 0.508, hole 0.305, Top Layer to Bottom Layer, 380 vias

## Routing (per net, layer and track width the routed paths; a pad name or vN(x,y) marks a point on that pad's centre or on a via; arc(x,y) is an arc through that point)
5V: length 178.7
  Top Layer w0.203: v3(53.55,6.5) 53.55,8 TP5.1 ; R41.1 v3(38,21.25)
  Top Layer w0.254: 10.09,35.62 9.84,35.62 v3(8.25,35.62) ; v3(9.14,19.74) 10.1,19.74 10.1,19.74
  Top Layer w0.508: 17.25,45.65 v3(17.25,45.12) 17.25,44.49 16.51,43.75 11.43,43.75 10.1,42.42 v3(10.1,9.38) ; 17.25,45.12 v3(17.25,45.65) 17.25,48.25 16.25,49.25 13.25,49.25 12.18,50.32 12.18,52.5 P1.4 P1.2
  Bottom Layer w0.203: C34.2 24.86,17.39 25.25,17 25.25,15 25.7,14.55 U6.1 ; U6.3 25.25,16.45
  Bottom Layer w0.254: 24.08,17.39 23.36,16.67 23.36,12.11 ; v3(38,21.25) 37.21,20.46 37.21,6.54 ; 9.11,34.36 8.63,34.36 8.25,34.73 8.25,35.62 ; v3(9.14,19.74) 9.14,18.77 9.11,18.74
  Bottom Layer w0.508: 17.25,45.65 17.25,44.4 15.75,42.9 ; U9.3 25.79,12.11 C36.2 ; C36.2 24.25,10.39 ; C36.2 23.36,12.11 23,11.75 23,6.5 ; U9.1 25.09,9.55 C37.2 ; v3(10.1,9.38) 12.98,6.5 56,6.5 58,8.5 58,13.5 58.75,14.25 60.75,14.25 61.75,15.25 61.75,17.44 60.76,16.45 55.75,16.45 ; 24.08,17.39 24.25,17.39
12V: length 58.4
  Top Layer w0.203: PIN1.1 33.03,47.69 34.85,47.69 35.43,47.11 35.43,43.37 36.05,42.75 37.11,42.75 ; TP6.1 48.9,47.54 v3(48.9,47.94)
  Bottom Layer w0.381: 55.75,37.95 59.95,37.95 60.95,38.94 61.75,38.94 ; 61.75,38.94 61.05,38.94 59.87,40.12 59.87,47.87 58,49.75 52.62,49.75 50.82,47.94 35.06,47.94 34.8,47.68 33.02,47.68 PIN1.1
AVCC: length 226.3
  Top Layer w0.203: 64.77,41.84 65.41,41.84 66,42.44 ; 45.75,12.5 47.25,12.5 ; 45.75,34 46.71,34 47.24,33.46 v3(47.24,32.7) ; 64.77,18.35 66,17.12 66,15.39 ; 47.25,9.84 47.25,12.5 ; 47.25,9.84 45.08,7.68 37.21,7.68 36.07,8.82 36.07,14.03 34.81,15.28 30.66,15.28 v3(30.35,15.6) ; 47.25,9.84 48.05,9.05 TP4.1
  Inner1 w0.203: v3(48.29,26.94) 48.31,26.96 v3(48.31,29.22) 48.34,29.25 ; 31.75,43.87 30.23,43.87 28.58,45.52 21.08,45.52 16.38,40.83 v3(13.21,40.83)
  Bottom Layer w0.203: 15.14,32.5 14.58,32.5 13.67,33.4 6.28,33.4 5.21,32.33 ; 64.77,41.84 64.2,41.84 63.6,41.25 63.6,37.12 62.61,36.13 59.06,36.13 58.17,35.24 58.17,31.17 55.88,28.89 48.65,28.89 v3(48.31,29.22) ; 64.77,18.35 63.63,19.49 63.63,24.82 62.54,25.91 60.12,25.91 58.78,27.26 48.61,27.26 v3(48.29,26.94) 45.72,24.37 45.72,14.03 47.25,12.5 ; v3(13.21,40.82) 11.05,38.66 5.86,38.66 4.5,37.3 4.5,33.04 5.21,32.33 5.21,16.31 4.06,15.17 4.06,11.23 5.21,10.09 10.16,10.09 13.26,7 21.62,7 22.5,7.87 22.5,12.02 22.99,12.5 22.99,17.51 23.61,18.13 25,18.13 25.63,17.5 27.25,17.5 27.75,17 27.75,16.25 28.4,15.6 30.35,15.6 31.25,15.61 30.19,14.55 29.05,14.55 ; 48.34,29.25 47.24,30.34 v3(47.24,32.7)
  Bottom Layer w0.254: 17.45,32.5 15.14,32.5 15.64,32 17.45,32
  vias: v3(47.25,12.5) v3(64.77,41.84) v3(64.77,18.35)
GND: length 218.4
  Top Layer w0.203: 37.22,40.75 37.27,40.7 ; 37.22,40.75 37.11,40.86 R26.2 37.22,40.75 ; 37.22,40.75 v3(38,40.75) ; v3(43.56,9.58) 44.48,10.5 45.75,10.5 ; 37.11,13.25 v3(38,13.25) ; v3(35.94,44.38) 36.3,44.75 37.11,44.75 ; C78.1 v3(41.5,11.25) ; C49.1 v3(41.5,40.75) ; 84.18,53 v3(85.18,53) ; 40.61,32.75 v3(41.5,32.75) ; 40.61,36.75 v3(39.72,36.75) ; 84.18,7 v3(85.18,7) ; 37.11,19.25 37.11,19.14 38,18.25 ; 37.11,34.75 v3(37.11,35.87) ; 37.11,23.25 v3(38,23.25) ; 40.61,15.25 v3(41.5,15.25) ; 45.75,32 v3(48.26,32) ; 40.61,42.75 v3(41.5,42.75) ; 37.11,25.25 37.11,25.05 v3(37.97,24.19) ; v3(37.11,45.86) 37.11,46.75 ; v3(38,15.25) 38.89,15.25 ; R46.2 v3(41.5,21.25) ; 39.61,18.25 40.61,19.25 ; 37.11,36.75 v3(38,36.75)
  Top Layer w0.254: 5.11,25.24 5.11,24.66 5.71,24.06 v3(7.87,24.06)
  Inner1 w0.203: P1.39 58.93,48.93 62.75,48.93 68.01,54.19 80.59,54.19 81.78,53 85.18,53 ; v3(85.18,7) 82.21,7 79.02,10.19 48.88,10.19 48.57,10.5 v3(48.48,10.5)
  Inner2 w0.508: 0.75,28 6.25,28 0.75,28
  Bottom Layer w0.203: U6.2 27.5,15.5 ; 34.86,25.5 35.54,24.82 v3(35.81,24.82) ; R28.2 v3(34.86,35.11) ; 13.36,29 12.33,29 v3(12.33,29.01) ; U3.74 34.12,22.5 34.54,22.92 35.72,22.92 36.64,22 37.18,22.54 v3(37.97,22.54) ; v3(31.24,11.23) 31.24,10.4 31.25,10.39 ; U1.4 v3(21.03,8) ; 31.25,13.89 v3(32.14,13.89) ; v3(39.75,42.73) 39.75,43.33 C12.2 ; v3(32.38,14.66) 32.38,15.93 31.25,17.07 31.25,17.39 ; C82.1 87.89,53.5 85.68,53.5 v3(85.18,53) ; 24.13,38.8 25.27,38.8 25.5,38.57 25.5,37.86 ; v3(33.91,35.11) 33.91,33.45 34.86,32.5 ; 34.86,27.25 34.53,27.25 v3(34.04,27.74) ; 19,15.47 C17.1 19.81,17.17 19.81,18.98 19.5,19.29 19.5,20.45 ; 23.75,37.86 23.75,38.54 23.5,38.8 22.77,38.8 ; 85.18,7 85.68,7.5 87.89,7.5 88.64,6.75 ; v3(15.14,23.11) 15.14,24.05 15.44,24.35 15.78,24.35 16.13,24.7 16.13,26.22 16.41,26.5 17.45,26.5 ; U3.27 19.5,36.95 19.09,37.35 19.09,38.73 20,39.64 v3(20,40.53) ; 13.3,16 v3(13.3,17.2) ; 17.45,31.5 14.36,31.5 13.36,32.5 12.38,32.5 12.1,32.22 v3(12.1,31.3) ; v3(13.36,21.36) 13.36,22.25 ; v3(35.75,23.75) 36.64,23.75 ; 88.64,3.25 88.64,6.75 ; 34.86,29 34.59,29.27 v3(34.04,29.27) ; R19.2 v3(61.75,27) ; R12.2 v3(22,17.25) ; v3(38,41.49) 38,43.61 ; v3(12.06,30.54) 12.45,30.54 12.7,30.79 13.32,30.79 C13.1 ; 22,37.86 v3(22,38.75) ; 88.64,52.75 88.64,49.25 ; v3(34.04,30.75) 34.86,30.75 ; v3(30.11,39.64) 31,39.64 ; v3(24.25,7.72) C37.1 ; 29.25,39.64 v3(29.25,40.53) ; v3(24.25,14.79) 24.25,15.61
  Bottom Layer w0.254: U2.0 22.2,45 22.8,44.4 v3(22.8,40.6) ; v3(11.18,27.62) 10.29,26.73 9.11,26.73 ; v3(6.35,11.11) 9.11,11.11
  Bottom Layer w0.508: v3(55,45.25) 57.85,45.25 ; 61.75,43.55 61.75,45.88 v3(60.96,46.67) ; v3(61,25.25) 61.75,24.5 61.75,22.05 ; 26.45,10.5 27.5,10.5 27.75,10.25 27.75,8.75 27.5,8.5 25.75,8.5 ; v3(55,23.75) 57.85,23.75
  vias: v1(48.5,41.25) v1(48.5,40.25) v1(48.5,39.25) v1(48.5,38.25) v1(48.5,37.25) v1(48.5,36.25) v1(48.5,19.75) v1(48.5,18.75) v1(48.5,17.75) v1(48.5,16.75) v1(48.5,15.75) v1(48.5,14.75) v1(49.5,41.25) v1(49.5,40.25) v1(49.5,39.25) v1(49.5,38.25) v1(49.5,37.25) v1(49.5,36.25) v1(49.5,19.75) v1(49.5,18.75) v1(49.5,17.75) v1(49.5,16.75) v1(49.5,15.75) v1(49.5,14.75) v1(50.5,41.25) v1(50.5,40.25) v1(50.5,39.25) v1(50.5,38.25) v1(50.5,37.25) v1(50.5,36.25) v1(50.5,19.75) v1(50.5,18.75) v1(50.5,17.75) v1(50.5,16.75) v1(50.5,15.75) v1(50.5,14.75) v3(19,15.47) v3(22.77,38.8) v3(24.13,38.8) v3(25.75,8.5) v3(27.5,15.5) v3(38,18.25) v3(39.61,18.25) v3(55.5,45.25) v3(55.5,23.75)
PGND: length 231.5
  Top Layer w0.203: RN1.1 62.1,32.75 62.8,32.75 v3(63,32.55) ; v3(63,34.15) 62.8,34.35 62.1,34.35 RN1.3 ; 64.75,7 64.96,6.79 65.28,6.79 65.4,6.91 65.4,8.44 62.61,11.23 61.9,11.23 RN2.1 ; RN2.3 62.1,12.85 62.5,12.85 v3(62.7,12.65) ; 73.8,20 73.5,20 72.87,19.37 68.01,19.37 63.83,23.55 v3(62.99,23.55) ; v3(52.25,18) 53.25,18 ; 73.8,47 73.5,47 72.76,46.26 66.5,46.26 65,44.76 v3(63.25,44.76) ; v3(52.25,39.5) 53.25,39.5
  Top Layer w0.305: C59.1 v3(59.28,30.75) C60.1 ; 58.39,42.75 58.39,44.75 ; v3(64.75,8) 62.66,10.09 60.95,10.09 60.11,9.25 58.39,9.25 ; v3(63.25,45.52) 61.28,45.52 60.96,45.21 60.96,43.95 60.76,43.75 58.39,43.75 ; C64.1 58.39,23.25 ; 58.39,21.25 59.5,20.13 v3(60.97,20.13) 60.98,20.14
  Inner1 w0.203: v3(62.99,23.55) 62.99,23.56 60.63,23.56 59.53,22.46 58.77,22.46 54.31,18 v3(52.25,18) ; v3(63.25,44.76) 60.34,44.76 59.53,43.96 58.77,43.96 54.31,39.5 52.25,39.5 ; v3(62.7,12.65) 62.5,12.85 61.35,12.85 61,12.5 61,11.48 61.25,11.23 71.3,11.23 72.39,12.32 72.39,13.84 73.47,14.92 78.74,14.92 79.5,15.67 v3(79.5,18.3) ; v3(79.5,36.3) 79.5,34.09 78.77,33.36 73.63,33.36 71.86,35.13 67.64,35.13 64.35,31.85 61,31.85 60.8,32.05 60.8,32.55 61,32.75 62.8,32.75 63,32.55 ; v3(79.5,6.5) 79.16,6.15 78.13,6.15 76.1,8.19 67.69,8.19 66.29,6.79 64.96,6.79 64.75,7 ; v3(79.5,45.3) 79.5,42.85 78.77,42.12 73.69,42.12 72.49,40.93 72.49,37.12 71.63,36.25 67.12,36.25 65.97,35.11 64.59,35.11 63.75,35.95 60.79,35.95 60.4,35.56 60.4,34.75 60.8,34.35 62.8,34.35 v3(63,34.15)
  Bottom Layer w0.203: R19.1 63.75,27 64.25,26.5 65.86,26.5 ; v3(79.5,6.5) 76,6.5 75.4,7.1 75.4,9.3 ; 75.4,45.3 v3(79.5,45.3) ; 75.4,36.3 v3(79.5,36.3) ; 75.4,18.3 v3(79.5,18.3)
  Bottom Layer w0.254: v3(64.75,8) 65.39,8 66.19,7.2 66.19,5.5
  Bottom Layer w0.305: 66.19,31.68 60.21,31.68 v3(59.28,30.75) ; v3(60.97,20.13) 62.5,18.6 63.5,18.6 65.02,17.08 65.66,17.08 66.19,16.54 66.19,14.5 ; v3(63.25,45.52) 65.72,45.52 66.19,46
  vias: v2(73.8,48.6) v2(73.8,47.8) v2(73.8,47) v2(73.8,21.6) v2(73.8,20.8) v2(73.8,20) v2(74.6,48.6) v2(74.6,47.8) v2(74.6,47) v2(74.6,21.6) v2(74.6,20.8) v2(74.6,20) v2(75.4,48.6) v2(75.4,47.8) v2(75.4,47) v2(75.4,21.6) v2(75.4,20.8) v2(75.4,20) v2(76.2,48.6) v2(76.2,47.8) v2(76.2,47) v2(76.2,21.6) v2(76.2,20.8) v2(76.2,20) v2(77,48.6) v2(77,47.8) v2(77,47) v2(77,21.6) v2(77,20.8) v2(77,20) v2(84.75,33.55) v2(84.75,32.55) v2(84.75,31.55) v2(84.75,30.55) v2(84.75,29.55) v2(85.25,33.05) v2(85.25,32.05) v2(85.25,31.05) v2(85.25,30.05) v2(85.25,29.05) v2(85.75,33.55) v2(85.75,32.55) v2(85.75,31.55) v2(85.75,30.55) v2(85.75,29.55) v2(86.25,33.05) v2(86.25,32.05) v2(86.25,31.05) v2(86.25,30.05) v2(86.25,29.05) v2(86.75,33.55) v2(86.75,32.55) v2(86.75,31.55) v2(86.75,30.55) v2(86.75,29.55) v2(87.25,33.05) v2(87.25,32.05) v2(87.25,31.05) v2(87.25,30.05) v2(87.25,29.05) v2(87.75,33.55) v2(87.75,32.55) v2(87.75,31.55) v2(87.75,30.55) v2(87.75,29.55) v2(88.25,33.05) v2(88.25,32.05) v2(88.25,31.05) v2(88.25,30.05) v2(88.25,29.05) v2(88.75,33.55) v2(88.75,32.55) v2(88.75,31.55) v2(88.75,30.55) v2(88.75,29.55) v2(89.25,33.05) v2(89.25,32.05) v2(89.25,31.05) v2(89.25,30.05) v2(89.25,29.05) v3(64.75,7)
VBUS_S: length 52.1
  Top Layer w0.203: 33.66,29.65 v3(27.94,29.65) 33.66,29.65 ; 33.66,29.65 v3(34.04,30.03) 33.66,29.65
  Bottom Layer w0.203: v3(34.03,30.03) 34.29,29.78 35.67,29.78 36.64,30.75 36.64,29 37.3,29 38.23,28.07 59.99,28.07 60.86,28.95 60.86,29 ; U3.31 21.5,34.05 25.91,29.65 v3(27.94,29.65)
VCC: length 292.4
  Top Layer w0.127: v3(18.81,10.18) KEY.5
  Top Layer w0.203: v3(50.7,49.8) 50.7,43.3 52,42 53.25,42 ; 84.18,49 v3(85.18,49) ; TP3.1 43.7,8.25 v3(38.9,8.25) ; R25.1 v3(39.78,30.75) ; 38.89,32.75 v3(39.78,32.75) ; 4.75,9.25 4.75,10.61 ; 25.5,12.39 v3(25.5,13.28) ; 53.25,20.5 52,20.5 49,23.5 49,25 ; v3(11.5,23.11) 11.5,26.76 13.65,28.91 13.65,31.85 ; 84.18,3 v3(85.18,3) ; 42.39,9.25 41.42,10.22 39.86,10.22 38.89,9.25 v3(39.78,9.25) ; R43.1 v3(39.78,11.25) ; R23.1 v3(43.28,30.75)
  Top Layer w0.254: CN6.1 3.64,21.35 2.92,20.63 v3(2.92,20.13) ; 15.05,31.85 15.05,34.42 16,35.37 16,37.27 ; CN1.1 4.25,37.12 3.77,36.64 v3(3.77,31.85) 3.77,30.58 4.1,30.24 CN4.1 ; 13.65,31.85 13.65,33.96 12.83,34.78 12.83,36.68 13.42,37.27 v3(15.29,37.27)
  Inner1 w0.203: v3(85.18,49) 83.34,49 79.78,52.57 68.69,52.57 63.43,47.31 52.71,47.31 49.68,44.28 46.1,44.28 43.28,41.46 v3(43.28,30.75) ; 85.18,3 83.91,3 78.35,8.57 40.46,8.57 39.78,9.25
  Bottom Layer w0.203: 23.75,39.64 v3(23.75,40.53) ; v3(11.5,23.11) v3(13.36,23.11) 13.36,24 14.12,24.76 15.53,24.76 15.75,24.97 15.75,26.6 16.14,27 17.45,27 ; v3(24.61,39.64) 25.5,39.64 ; U3.28 v3(20,38.75) ; v3(16,29.25) 16,29.75 15.75,30 15.35,30 15.14,30.21 15.14,30.75 16.09,30.75 16.33,31 17.45,31 ; v3(34.29,39.43) 33.4,39.43 31.83,37.86 31,37.86 U3.50 ; 20.99,42.38 20.99,43 20.5,43.5 18.5,43.5 17.99,42.99 17.99,42.38 ; v3(15.14,21.36) 15.14,22.3 15.77,22.93 15.77,23.83 16.42,24.48 17.44,24.48 17.45,24.5 ; 19,17.25 C17.2 ; H1.1 34,8.31 36.86,11.17 36.86,20.64 36.18,21.32 36.15,21.32 36.01,21.45 36.01,21.49 35.5,22 32.55,22
  Bottom Layer w0.254: 21.03,10.86 19.17,10.86 v3(18.54,11.49) ; v3(47,22.75) v3(48.5,22.75) ; v3(2.92,20.13) 4.06,20.13 4.57,20.63 4.57,31.04 v3(3.77,31.85) ; v3(28.57,27.36) 26.67,27.36 v3(24.13,29.9) ; 19,18.14 19,20.45 ; 23.75,39.64 22,39.64 20.97,40.66 20.97,42.43 ; 25.5,39.64 25.5,40.2 24.3,41.4 24.3,43.96 26.14,45.79 26.14,47.74 ; v3(12.83,14.28) 12.45,13.9 12.45,12.51 12.82,12.13 U1.7 ; 13.97,13.4 v3(13.97,14.28)
  Bottom Layer w0.508: v3(54.48,46.79) v3(54.48,49.08) ; v3(53.85,46.79) v3(53.85,49.08) ; v3(39.78,30.75) v3(39.78,32.75) ; 53.21,46.79 v3(53.21,49.08) ; H1.1 33.1,7.35 31.7,7.35 31.25,7.8 C38.2 29.89,8.61 29.05,9.45 29.05,9.55
  vias: v3(4.75,9.25) v3(16,37.27) v3(19,17.25) v3(49,25) v3(49.28,10.73) v3(49.28,7.68) v3(49.91,10.73) v3(49.91,7.68) v3(50.55,10.73) v3(50.55,7.68) v3(53.21,46.79)
(no net):
  vias: v1(0,56) v1(0,28) v1(0,0) v1(90,56) v1(90,0)
_GPIO_1: length 122.9
  Top Layer w0.127: v3(7.87,24.7) 7.3,24.7 6.73,25.27 6.73,34.87 6.48,35.12 CN1.3
  Inner1 w0.127: v3(50,49.77) 48.54,48.32 41.98,48.32 40.4,46.74 40.4,44.55 36.06,40.21 30.85,40.21 27.68,43.37 21.98,43.37 17.02,38.41 14.35,38.41 13.05,37.12 13.05,27.71 10.04,24.7 v3(7.87,24.7) 4.95,24.7 2.79,26.85 2.79,41.86 4.05,43.11 16.01,43.11 19.67,46.78 19.67,52.62 P1.10
  Bottom Layer w0.203: 50,48.89 50,49.78
_GPIO_2: length 124.8
  Top Layer w0.127: v3(7.87,25.33) 7.37,25.33 6.98,25.71 6.98,35.62 6.48,36.12 CN1.2
  Inner1 w0.127: P1.8 17.26,55.04 18.94,55.04 19.93,54.05 19.93,46.67 16.11,42.86 4.15,42.86 3.05,41.76 3.05,27.11 4.82,25.33 v3(7.87,25.33) 10.04,25.33 12.8,28.1 12.8,37.22 14.25,38.67 16.92,38.67 21.87,43.62 27.79,43.62 30.95,40.46 35.95,40.46 40.15,44.66 40.15,46.85 41.87,48.57 46.8,48.57 v3(48,49.78)
  Bottom Layer w0.203: 48,48.89 48,49.78
_GPIO_3: length 117.1
  Inner1 w0.127: v3(46,49.77) 45.05,48.83 41.77,48.83 39.9,46.95 39.9,44.76 35.85,40.71 31.06,40.71 27.89,43.88 21.77,43.88 16.81,38.92 14.14,38.92 12.54,37.33 12.54,30.29 10,27.74 v3(7.87,27.74) 4.83,27.74 3.3,29.27 3.3,41.65 4.26,42.61 16.22,42.61 22.23,48.61 22.23,52.61 P1.12
  Bottom Layer w0.127: 7.87,27.74 6.5,27.74 5.75,27 5.75,17.31 6.87,16.2 9.11,16.2
  Bottom Layer w0.203: 46,48.89 46,49.78
_GPIO_4: length 96.5
  Inner1 w0.127: v3(44,49.77) 43.31,49.08 41.66,49.08 39.64,47.06 39.64,44.87 35.77,40.99 31.14,40.99 28,44.13 21.66,44.13 16.71,39.18 14.04,39.18 12.24,37.38 12.24,32.49 v3(11.5,31.75) 4.89,31.75 3.56,33.08 3.56,41.55 4.36,42.35 16.32,42.35 22.48,48.51 22.48,51.75 23.24,52.51 24.89,52.51 P1.16
  Bottom Layer w0.127: 9.11,31.82 9.19,31.75 v3(11.5,31.75)
  Bottom Layer w0.203: 44,48.89 44,49.78
_GPIO_5: length 100.5
  Top Layer w0.127: 5.11,29.24 3.56,29.24 2.92,29.88 2.92,37.77 3.3,38.16 6.37,38.16 6.6,37.92 6.6,37.01 7.11,36.51 v3(7.49,36.51)
  Inner1 w0.127: 28.69,53.77 27.15,52.23 27.15,50.45 26.67,49.97 24.31,49.97 16.43,42.1 4.47,42.1 3.81,41.44 3.81,37.53 4.83,36.51 v3(7.49,36.51) 11.68,36.51 11.99,36.81 11.99,37.49 13.93,39.43 16.6,39.43 21.56,44.39 28.1,44.39 31.24,41.25 35.66,41.25 39.36,44.95 39.36,47.14 v3(42,49.77)
  Bottom Layer w0.203: 42,48.89 42,49.78
_GPIO_6: length 92.9
  Top Layer w0.127: CN6.2 6.45,20.35 6.73,20.63 6.73,22.16 6.1,22.79 3.68,22.79 2.67,23.81 2.67,37.88 3.2,38.41 6.48,38.41 6.86,38.03 6.86,37.52 7.11,37.27 v3(7.49,37.27) ; 15.99,51.23 15.99,50.24 17.78,48.44 17.78,44.26 16.77,43.24 11.69,43.24 10.67,42.22 10.67,38.23 v3(11.5,37.4)
  Inner1 w0.127: v3(11.5,37.4) 11.53,37.4 13.82,39.68 16.5,39.68 21.45,44.64 28.21,44.64 31.35,41.5 35.56,41.5 39.08,45.03 39.08,48.86 39.11,48.88 v3(40,49.77)
  Bottom Layer w0.127: v3(7.49,37.27) 8.51,38.28 10.61,38.28 v3(11.5,37.4)
  Bottom Layer w0.203: 40,48.89 40,49.78
_GPIO_7: length 110.6
  Top Layer w0.127: v3(7.49,38.03) 8,37.52 8,36.38 7.24,35.62 7.24,26.98 8.45,25.77 8.45,15.61 v3(9.14,14.92)
  Inner1 w0.127: 33.77,53.77 32.63,52.62 28,52.62 27.4,52.02 27.4,50.32 26.8,49.72 24.41,49.72 16.53,41.84 4.57,41.84 4.06,41.34 4.06,38.79 4.83,38.03 v3(7.49,38.03) 11.81,38.03 13.72,39.94 16.39,39.94 21.34,44.89 28.31,44.89 31.45,41.76 35.45,41.76 38.83,45.13 38.83,48.95 v3(38,49.77)
  Bottom Layer w0.127: 9.11,13.66 9.14,13.66 v3(9.14,14.92)
  Bottom Layer w0.203: 38,48.89 38,49.78
_GPIO_8: length 83.6
  Top Layer w0.127: 10.92,30.54 10.92,35.11 12.2,36.39 12.2,40.24 v3(11.56,40.88)
  Inner1 w0.127: v3(36,49.77) 38.57,47.2 38.57,45.24 35.35,42.01 31.56,42.01 28.39,45.17 21.26,45.17 16.28,40.19 12.25,40.19 v3(11.56,40.88) 12.27,41.59 16.64,41.59 24.52,49.47 26.93,49.47 27.65,50.19 27.65,51.9 28.12,52.37 34.91,52.37 36.31,53.77
  Bottom Layer w0.127: 9.11,29.28 9.11,30.13 9.52,30.54 10.92,30.54
  Bottom Layer w0.203: 36,48.89 36,49.78
  vias: v3(10.92,30.54)
_USB_DM: length 16
  Top Layer w0.127: v3(9.21,37.27) 9.02,37.46 9.02,38.13 9.49,38.6 9.49,43.45 8.86,44.08 8.1,44.08 7.43,44.75 6.62,44.75
  Bottom Layer w0.127: v3(9.21,37.27) 9.02,37.08 9.02,36.38 9.53,35.88 11.57,35.88 12.19,35.25 12.61,35.25 13.36,36
_USB_DP: length 15.9
  Top Layer w0.127: v3(8.57,37.27) 8.76,37.46 8.76,38.23 9.24,38.71 9.24,43.32 8.73,43.83 8.05,43.83 7.47,43.25 6.62,43.25
  Bottom Layer w0.127: v3(8.57,37.27) 8.76,37.08 8.76,36.28 9.42,35.62 11.46,35.62 12.09,35 12.61,35 R3.2
AUX_H: length 19.1
  Bottom Layer w0.127: 30,35.55 30,36.53 29.31,37.22 28.77,37.22 28.61,37.38 28.61,38.32 28.82,38.54 31.75,38.54 32.38,39.17 32.38,40.82 31.75,41.46 30.86,41.46 30.48,41.84 30.48,44.65 31.1,45.27 33.15,45.27 PIN4.1
AUX_L: length 24.1
  Bottom Layer w0.127: 29.5,35.55 29.5,36.65 29.18,36.97 28.66,36.97 28.34,37.29 28.34,38.43 28.7,38.79 31.62,38.79 32.13,39.3 32.13,40.7 31.62,41.2 30.73,41.2 30.22,41.71 30.22,49.46 30.86,50.09 33.15,50.09 PIN3.1
AUX_TEMP: length 27.2
  Top Layer w0.203: v3(21,38.62) 21,46.87 21.77,47.64 29.77,47.64 30.48,46.92 30.48,45.78 31.12,45.14 33.02,45.14 34.29,43.87
  Bottom Layer w0.203: U3.30 v3(21,38.62)
BOOT0: length 2.3
  Bottom Layer w0.127: 22,18.14 22,20.45
C39_2: length 2.5
  Bottom Layer w0.508: U9.4 29.71,12.11 31.25,12.11
C40_1: length 1.7
  Bottom Layer w0.508: 67.64,26.5 69.36,26.5
C43_2: length 3.4
  Top Layer w0.203: 38.89,44.75 40.61,44.75 38.89,44.75
C63_2: length 3.4
  Top Layer w0.203: 40.61,23.25 38.89,23.25 40.61,23.25
CAN_D: length 32.4
  Top Layer w0.127: v3(23.62,46.29) 26.03,46.29 26.54,45.78 26.54,37.15 v3(26.29,36.89)
  Inner1 w0.127: v3(20.96,22.28) 25.15,26.47 25.15,34.73 26.54,36.12 26.54,36.64 v3(26.29,36.89)
  Bottom Layer w0.127: 21,20.45 21,22.24 ; 23.6,47.74 23.6,46.31 v3(23.62,46.29)
CAN_H: length 43.2
  Bottom Layer w0.127: 25.7,40.65 25.4,40.95 25.4,41.72 24.87,42.26 ; 27.25,38.54 27.32,38.62 27.9,38.62 28.45,39.17 28.45,49.21 27.81,49.84 19.68,49.84 19.43,50.1 17.44,50.1 17.06,49.72 11.94,49.72 11.17,48.95 11.17,44 10.92,43.74 10.27,43.74 9.11,44.9 ; 27.25,37.86 27.25,38.54 ; 27.25,38.54 27.18,38.62 26.49,38.62 26.25,38.87 ; 25.7,40.65 26.1,40.65 26.25,40.5 26.25,38.87
CAN_L: length 41.9
  Bottom Layer w0.127: 9.11,42.36 10.25,43.49 11.05,43.49 11.43,43.87 11.43,48.82 12.07,49.46 17.17,49.46 17.55,49.84 19.33,49.84 19.58,49.59 27.68,49.59 28.19,49.08 28.19,39.3 27.77,38.87 27.32,38.87 27.25,38.95 27.17,38.87 26.6,38.87 26.5,38.97 26.5,40.61 26.28,40.83 26.2,40.9 25.81,40.9 25.66,41.05 25.66,41.78 U4.6 ; 27.25,38.95 27.25,39.64
CAN_R: length 29.9
  Top Layer w0.127: v3(27.41,46.31) 26.8,45.71 26.8,37.15 v3(27.05,36.89)
  Inner1 w0.127: v3(27.05,36.89) 26.8,36.64 26.8,36.02 25.4,34.62 25.4,26.09 v3(21.59,22.28)
  Bottom Layer w0.127: 27.43,46.29 27.41,46.31 27.41,47.74 ; 21.5,20.45 21.5,22.19
DCBUS: length 93.3
  Top Layer w0.127: C60.2 61.94,30.8
  Top Layer w0.254: 61.94,30.8 63.25,30.8
  Top Layer w0.305: 53.25,23 55.25,23 55.36,22.89 55.36,22.5 53.25,22.5 ; v3(63.23,8) 63.23,8.65 62.63,9.25 61.89,9.25 ; 55.36,44 55.36,43.14 55.75,42.75 56.61,42.75 57.61,41.75 62.63,41.75 64,40.37 64.74,40.37 66.47,38.64 68.09,38.64 ; 55.36,44 53.25,44 ; 55.36,44 55.36,44.39 55.25,44.5 53.25,44.5 ; 55.36,22.5 55.36,21.64 55.75,21.25 56.61,21.25 57.5,22.13 57.5,23.75 57.92,24.17 64.33,24.17 66.5,22 68.5,22 ; 61.89,30.75 61.89,29.99 61.3,29.4 57.05,29.4 56.61,29.83 C59.2 55.4,30.75 55.05,31.1 55.05,31.65 54.7,32 53.25,32 ; 61.89,9.25 61.89,8.49 61.3,7.9 57.05,7.9 56.61,8.33 56.61,9.25 55.4,9.25 55.05,9.6 55.05,10.15 54.7,10.5 53.25,10.5
  Inner1 w0.254: 63.25,30.8 67.56,30.8 67.77,31 68.5,31
  Inner1 w0.305: v2(68.5,5) 64.78,5 63.23,6.55 v3(63.23,8)
  Bottom Layer w0.203: 62.64,29 64.14,27.5 67.5,27.5 69,29 v2(69,30.5)
  Bottom Layer w0.508: 70.5,29 70.5,27.14 71.14,26.5
  vias: v2(68.5,51) v2(68.5,50) v2(68.5,49) v2(68.5,42) v2(68.5,41) v2(68.5,40) v2(68.5,33) v2(68.5,32) v2(68.5,31) v2(68.5,24) v2(68.5,23) v2(68.5,22) v2(68.5,15) v2(68.5,14) v2(68.5,13) v2(68.5,6) v2(68.5,4) v2(69,50.5) v2(69,49.5) v2(69,48.5) v2(69,41.5) v2(69,40.5) v2(69,39.5) v2(69,32.5) v2(69,31.5) v2(69,23.5) v2(69,22.5) v2(69,21.5) v2(69,14.5) v2(69,13.5) v2(69,12.5) v2(69,5.5) v2(69,4.5) v2(69,3.5) v2(69.5,51) v2(69.5,50) v2(69.5,49) v2(69.5,42) v2(69.5,41) v2(69.5,40) v2(69.5,33) v2(69.5,32) v2(69.5,31) v2(69.5,24) v2(69.5,23) v2(69.5,22) v2(69.5,15) v2(69.5,14) v2(69.5,13) v2(69.5,6) v2(69.5,5) v2(69.5,4) v2(70,50.5) v2(70,49.5) v2(70,48.5) v2(70,41.5) v2(70,40.5) v2(70,39.5) v2(70,32.5) v2(70,31.5) v2(70,30.5) v2(70,23.5) v2(70,22.5) v2(70,21.5) v2(70,14.5) v2(70,13.5) v2(70,12.5) v2(70,5.5) v2(70,4.5) v2(70,3.5) v2(70.5,51) v2(70.5,50) v2(70.5,49) v2(70.5,42) v2(70.5,41) v2(70.5,40) v2(70.5,33) v2(70.5,32) v2(70.5,31) v2(70.5,24) v2(70.5,23) v2(70.5,22) v2(70.5,15) v2(70.5,14) v2(70.5,13) v2(70.5,6) v2(70.5,5) v2(70.5,4) v2(71,50.5) v2(71,49.5) v2(71,48.5) v2(71,41.5) v2(71,40.5) v2(71,39.5) v2(71,32.5) v2(71,31.5) v2(71,30.5) v2(71,23.5) v2(71,22.5) v2(71,21.5) v2(71,14.5) v2(71,13.5) v2(71,12.5) v2(71,5.5) v2(71,4.5) v2(71,3.5) v2(71.5,51) v2(71.5,50) v2(71.5,49) v2(71.5,42) v2(71.5,41) v2(71.5,40) v2(71.5,33) v2(71.5,32) v2(71.5,31) v2(71.5,24) v2(71.5,23) v2(71.5,22) v2(71.5,15) v2(71.5,14) v2(71.5,13) v2(71.5,6) v2(71.5,5) v2(71.5,4) v2(84.75,26.5) v2(84.75,25.5) v2(84.75,24.5) v2(84.75,23.5) v2(84.75,22.5) v2(85.25,27) v2(85.25,26) v2(85.25,25) v2(85.25,24) v2(85.25,23) v2(85.75,26.5) v2(85.75,25.5) v2(85.75,24.5) v2(85.75,23.5) v2(85.75,22.5) v2(86.25,27) v2(86.25,26) v2(86.25,25) v2(86.25,24) v2(86.25,23) v2(86.75,26.5) v2(86.75,25.5) v2(86.75,24.5) v2(86.75,23.5) v2(86.75,22.5) v2(87.25,27) v2(87.25,26) v2(87.25,25) v2(87.25,24) v2(87.25,23) v2(87.75,26.5) v2(87.75,25.5) v2(87.75,24.5) v2(87.75,23.5) v2(87.75,22.5) v2(88.25,27) v2(88.25,26) v2(88.25,25) v2(88.25,24) v2(88.25,23) v2(88.75,26.5) v2(88.75,25.5) v2(88.75,24.5) v2(88.75,23.5) v2(88.75,22.5) v2(89.25,27) v2(89.25,26) v2(89.25,25) v2(89.25,24) v2(89.25,23) v3(63.25,30.8)
EN_GATE: length 74.7
  Top Layer w0.203: U8.16 44.76,16.5 TP1.1 ; 45.75,38 v3(47.25,38) 45.75,38 ; v3(47.25,16.5) 45.75,16.5 v3(47.25,16.5)
  Inner1 w0.127: 47.25,38 46.59,38 45.06,36.46 45.06,29.6 42.95,27.49 38.45,27.49 36.55,29.39 36.55,31.87 34.42,34 v3(31.25,34) 30.51,34 28.5,31.99 28.5,28.18 27.43,27.11 27.43,20.37 28.06,19.74 41.15,19.74 44.39,16.5 47.25,16.5
  Bottom Layer w0.203: 31.25,34 32.55,34
F1_1: length 3.2
  Bottom Layer w0.508: 15.75,47.1 15.25,46.6 12.75,46.6
FLASH_NCS: length 24.7
  Inner1 w0.127: v3(24.62,33.5) 24.89,33.23 24.89,26.89 20.19,22.19 20.19,18.55 v3(21,17.75)
  Bottom Layer w0.127: 21.03,13.4 21,13.43 v3(21,17.75) ; v3(24.62,33.5) 25,33.87 U3.38
FREEIO_1: length 20.5
  Top Layer w0.127: P2.19 30.1,3.36 30.1,7.15 27.81,9.44 27.81,14.15 26.41,15.55 26.41,17.96 26.67,18.22
  Bottom Layer w0.127: 27,20.45 27,18.55 26.67,18.22
  vias: v3(26.67,18.22)
FREEIO_2: length 17.1
  Top Layer w0.127: P2.18 28.69,8.2 27.56,9.33 27.56,14.03 26.16,15.42 26.16,17.96 25.91,18.22
  Bottom Layer w0.127: 26.5,20.45 26.5,18.81 v3(25.91,18.22)
FREEIO_3: length 21.2
  Top Layer w0.127: v3(25.65,18.85) 25.27,18.47 25.27,15.93 27.3,13.9 27.3,7.93 25.15,5.77 22.08,5.77 P2.12
  Bottom Layer w0.127: 26,20.45 26,19.2 25.65,18.85
FREEIO_4: length 23.3
  Top Layer w0.127: P2.10 19.79,6.03 25.02,6.03 27.05,8.06 27.05,13.77 25.02,15.8 25.02,18.85
  Bottom Layer w0.127: 25.5,20.45 25.5,19.33 v3(25.02,18.85)
FREEIO_5: length 25.7
  Top Layer w0.127: v3(24.38,18.85) 24.76,18.47 24.76,15.68 26.8,13.65 26.8,8.18 24.89,6.28 17.5,6.28 P2.8
  Bottom Layer w0.127: v3(24.38,18.85) 25,19.47 25,20.45
FREEIO_6: length 35
  Top Layer w0.127: v3(21.33,18.85) 21.85,18.34 23.72,18.34 24.51,17.55 24.51,15.55 26.54,13.52 26.54,8.31 24.76,6.53 13.21,6.53 12.32,5.64 12.32,3.36 P2.5
  Bottom Layer w0.127: 20.5,20.45 20.5,19.69 v3(21.34,18.85)
FREEIO_7: length 35.2
  Top Layer w0.127: v3(20.7,18.85) 21.46,18.09 23.62,18.09 24.26,17.46 24.26,15.42 26.29,13.39 26.29,8.44 24.64,6.79 13.08,6.79 12.06,5.77 12.06,3.38 P2.3
  Bottom Layer w0.127: 20,20.45 20,19.55 v3(20.7,18.85)
FREEIO_8: length 22.4
  Top Layer w0.127: v3(28.96,21.9) 29.84,21.01 29.84,10.28 34.1,6.03 35.05,6.03 P2.24
  Bottom Layer w0.127: 28.5,20.45 28.5,21.45 v3(28.96,21.9)
FREEIO_9: length 21
  Top Layer w0.127: P2.22 33.77,5.99 29.59,10.17 29.59,20.63 v3(28.32,21.9)
  Bottom Layer w0.127: v3(28.32,21.9) 28,21.58 28,20.45
FREEIO_10: length 30.4
  Top Layer w0.127: v3(34.42,42.48) 33.51,41.57 33.51,39.14 31.75,37.37 31.75,32.49 v3(31.25,32)
  Inner1 w0.127: 35.24,43.49 35.24,43.3 v3(34.42,42.48) ; 35.24,43.49 35.25,43.49 35.25,44.09 35.24,44.1 ; 35.24,43.49 35.24,44.1 ; 35.24,44.1 35.24,44.67 35.25,44.68 35.25,51.87 35.75,52.37 40,52.37 41.39,53.77 ; 35.24,43.48 35.24,43.49
  Bottom Layer w0.127: 31.25,32 U3.55
FREEIO_11: length 24.2
  Top Layer w0.127: v3(30.75,31.5) 31.38,31.5 32,32.12 32,37.27 33.77,39.03 33.77,41.19 v3(35.05,42.48)
  Inner1 w0.127: v3(35.05,42.48) 35.5,42.93 35.5,44.2 35.5,44.2 35.5,44.57 35.5,44.57 35.5,50.42 36.31,51.23
  Bottom Layer w0.127: v3(30.75,31.5) U3.56
FREEIO_12: length 30.6
  Top Layer w0.127: v3(30.25,32) 30.25,36.28 33.26,39.29 33.26,41.95 v3(33.78,42.48)
  Inner1 w0.127: 38.85,53.77 37.71,52.62 35.62,52.62 34.93,51.92 34.93,50.42 34.5,50 33.75,50 33.27,49.52 33.27,42.99 v3(33.78,42.48)
  Bottom Layer w0.127: U3.57 30.5,31 30.25,31.25 30.25,32
FREEIO_13: length 25.2
  Top Layer w0.127: v3(29.75,31.5) 29.75,32.73 30,32.98 30,36.38 33,39.39 33,42.11 v3(32.64,42.48)
  Inner1 w0.127: v3(32.64,42.48) 33,42.84 33,50.46 33.77,51.23
  Bottom Layer w0.127: v3(29.75,31.5) 29.75,31 30.25,30.5 U3.58
FREEIO_14: length 26.7
  Top Layer w0.127: v3(29.25,32) 29.25,32.59 29.72,33.06 29.72,36.47 32.75,39.5 32.75,41.73 v3(32,42.48)
  Inner1 w0.127: 31.23,51.23 32.75,49.71 32.75,43.22 v3(32,42.48)
  Bottom Layer w0.127: U3.59 30.12,30 29.25,30.87 29.25,32
GPIO_1: length 65.7
  Inner1 w0.127: v3(36.07,35.62) 34.53,35.62 32.25,37.9 26.67,37.9 24.01,35.24 18.63,35.24 16.88,33.5 14.7,33.5 14.1,34.1 14.1,34.73 v3(13.72,35.11)
  Bottom Layer w0.127: v3(13.72,35.11) 14.1,35.11 ; 14.1,35.11 14.1,33.81 14.7,33.21 16,33.21 16.21,33 17.45,33 ; 14.1,35.11 14.1,39.79 15.13,40.83 18.67,40.83 18.99,41.15 18.99,42.38 ; 36.07,35.62 36.58,35.11 37.21,35.11 38.66,36.56 38.66,37.65 40,38.99 40,40.83 40.9,41.72 44.58,41.72 45.34,42.48 45.34,44.13 45.59,44.38 48.99,44.38 50,45.39 50,47.11
GPIO_2: length 61.9
  Inner1 w0.127: 35.56,36.13 34.38,36.13 32.36,38.15 26.56,38.15 23.9,35.5 18.52,35.5 16.78,33.75 14.84,33.75 14.35,34.24 14.35,34.73 v3(14.73,35.11)
  Bottom Layer w0.127: 14.35,35.11 14.35,39.69 15.24,40.57 19.3,40.57 19.99,41.26 19.99,42.38 ; 14.35,35.11 v3(14.73,35.11) ; 14.35,35.11 14.35,33.92 14.77,33.5 17.45,33.5 ; v3(35.56,36.13) 36.58,36.13 39.75,39.3 39.75,40.95 40.77,41.97 44.45,41.97 45.09,42.61 45.09,44.25 45.47,44.63 47.2,44.63 47.95,45.39 48,45.39 48,47.11
GPIO_3: length 41.4
  Inner1 w0.127: 16.08,34.37 17.04,34.37 18.42,35.75 23.8,35.75 26.46,38.4 32.46,38.4 34.23,36.64 v3(36.07,36.64)
  Bottom Layer w0.127: 46,47.11 46,45.39 45.86,45.25 45.19,45.25 44.83,44.89 44.83,42.73 44.32,42.23 40.64,42.23 39.5,41.08 39.5,39.56 36.58,36.64 36.07,36.64 ; 17.45,34 16.45,34 16.08,34.37
  vias: v3(16.08,34.37)
GPIO_4: length 38.8
  Inner1 w0.127: v3(16.89,36) 23.69,36 26.35,38.66 32.57,38.66 34.08,37.15 35.56,37.15
  Bottom Layer w0.127: 19,35.55 17.27,35.55 16.89,35.92 v3(16.89,36) ; v3(35.56,37.15) 36.58,37.15 39.24,39.81 39.24,44.09 39.53,44.38 42.99,44.38 44,45.39 44,47.11
GPIO_5: length 30.8
  Inner1 w0.127: v3(22.86,37.47) 22.86,36.89 23.24,36.51 23.84,36.51 26.25,38.91 32.67,38.91 33.93,37.65 v3(36.07,37.65)
  Bottom Layer w0.127: 42,47.11 42,45.39 41.25,44.63 39.4,44.63 38.99,44.23 38.99,40.07 36.58,37.66 36.07,37.66 ; U3.33 22.5,37.1 22.86,37.46 v3(22.86,37.47)
GPIO_6: length 27.4
  Inner1 w0.127: v3(23.5,37.02) 23.99,37.02 26.15,39.18 32.77,39.18 33.78,38.16 35.56,38.16
  Bottom Layer w0.127: v3(23.5,37.02) 24.21,37.02 24.5,36.73 U3.37 ; 40,47.11 40,45.39 39.36,45.39 38.73,44.76 38.73,40.32 36.58,38.16 v3(35.56,38.16)
GPIO_7: length 41.7
  Inner1 w0.127: v3(33,36.25) 32.27,36.25 31.13,37.39 28.88,37.39 25.91,34.41 25.91,22.41 v3(25.27,21.77)
  Bottom Layer w0.127: 25.27,21.77 25.91,22.41 29.84,22.41 30.5,21.75 30.5,20.45 ; v3(33,36.25) 33,36.26 37.25,40.51 37.25,44.64 38,45.39 38,47.11
GPIO_8: length 36.1
  Inner1 w0.127: v3(24.64,21.77) 25.65,22.79 25.65,34.52 28.78,37.64 31.23,37.64 32.13,36.75 v3(32.5,36.75)
  Bottom Layer w0.127: 24.5,20.45 24.5,20.45 24.5,21.38 24.64,21.52 24.64,21.78 ; v3(32.5,36.75) 33.13,36.75 33.9,37.52 37,40.61 37,44.44 36.05,45.39 36,45.39 36,47.11
GVDD: length 7.8
  Top Layer w0.254: 43.64,39.5 C49.2 43.64,39.5 ; 43.64,39.5 45.75,39.5 43.64,39.5
GVDD2: length 7.8
  Top Layer w0.203: 43.64,18 42.39,19.25 43.64,18 ; 43.64,18 45.75,18 43.64,18
LED1_1: length 1.8
  Top Layer w0.203: 23.75,10.61 25.5,10.61
M0_AH: length 67.4
  Top Layer w0.203: v3(46.75,37.5) 45.75,37.5 v3(46.75,37.5)
  Inner1 w0.127: 43.58,25.97 34.04,25.97 ; 43.58,25.97 46.58,28.97 ; 43.58,25.97 34.04,25.97 ; 43.58,25.97 46.58,28.97 ; 34.04,25.97 31.55,28.46 ; 34.04,25.97 31.55,28.46 ; 31.55,28.46 30.53,28.46 ; 31.55,28.46 30.53,28.46 ; 30.53,28.46 30.02,27.94 ; 30.53,28.46 30.02,27.94 ; 48.2,34.4 46.58,32.78 ; 48.2,34.4 46.58,32.78 ; 48.2,34.4 48.2,35.39 ; 48.2,34.4 48.2,35.39 ; 46.58,32.78 46.58,28.97 ; 46.58,32.78 46.58,28.97 ; 48.2,35.39 48,35.59 ; 48.2,35.39 48,35.59 ; 48,35.59 48,36.87 ; 48,35.59 48,36.87 ; 48,36.87 47.38,37.5 ; 48,36.87 47.38,37.5 ; 30.02,27.94 30.02,26.59 ; 30.02,27.94 30.02,26.59 ; 47.38,37.5 46.75,37.5 47.38,37.5 ; 30.02,26.59 30.61,26 ; 30.02,26.59 30.61,26 ; 30.61,26 v3(31.25,26) 30.61,26
  Bottom Layer w0.127: 31.25,26 32.55,26
M0_AL: length 61.2
  Top Layer w0.203: v3(47.25,37) 45.75,37 v3(47.25,37)
  Inner1 w0.127: 34.56,33.5 v3(30.75,33.5) 34.56,33.5 ; 34.56,33.5 36.29,31.76 ; 34.56,33.5 36.29,31.76 ; 45.31,35.69 46.62,37 ; 45.31,35.69 46.62,37 ; 45.31,35.69 45.31,29.5 ; 45.31,35.69 45.31,29.5 ; 46.62,37 47.25,37 46.62,37 ; 36.29,29.28 36.74,28.84 ; 36.29,29.28 36.74,28.84 ; 36.29,29.28 36.29,31.76 ; 36.29,29.28 36.29,31.76 ; 36.74,28.84 38.34,27.24 ; 36.74,28.84 38.34,27.24 ; 38.34,27.24 43.05,27.24 ; 38.34,27.24 43.05,27.24 ; 43.05,27.24 44.47,28.66 ; 43.05,27.24 44.47,28.66 ; 44.47,28.66 45.31,29.5 ; 44.47,28.66 45.31,29.5
  Bottom Layer w0.203: 30.75,33.5 U3.52
